# Altium schematic sheet 05_POWER_MCU_1.SchDoc
size 420 x 297 mm; SheetNumber: 8; SheetTotal: 29
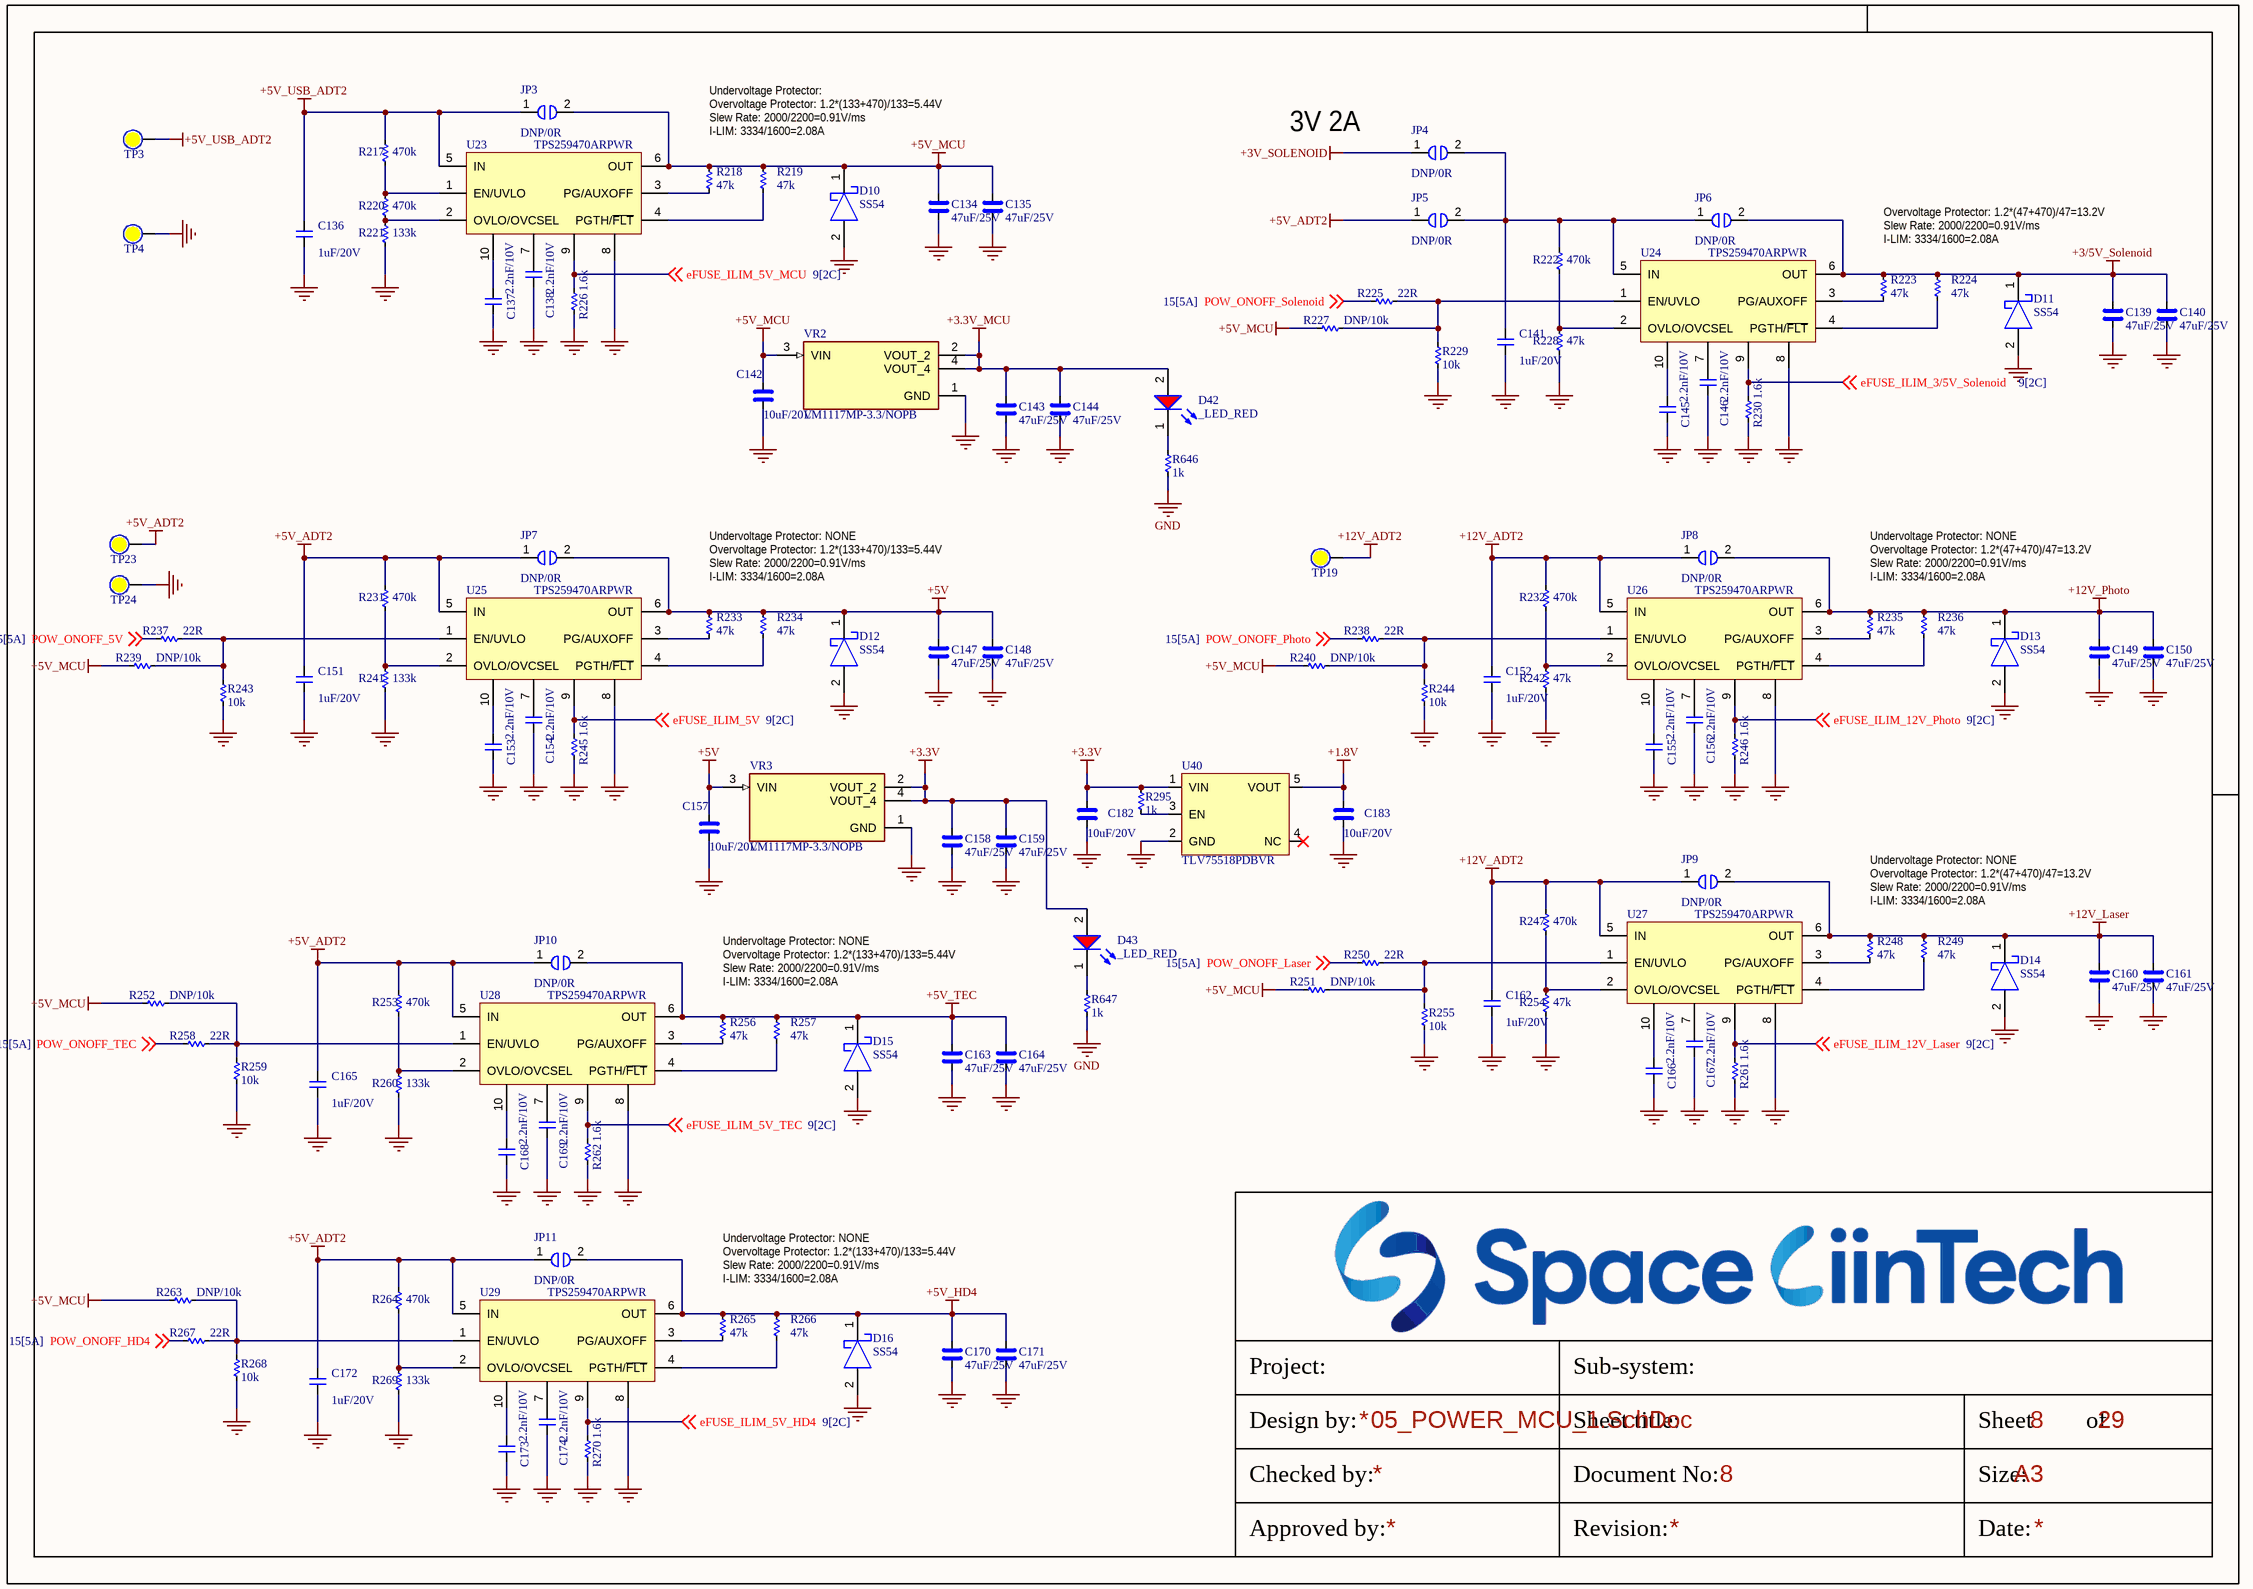
[diagram p0: 05_POWER_MCU_1.SchDoc]

## Parts
C134  47uF/25V  [CAP_C_3225X80]
C135  47uF/25V  [CAP_C_3225X80]
C136  1uF/20V  [CAP_C_1005X60]
C137  2.2nF/10V  [CAP_C_1005X60]
C138  2.2nF/10V  [CAP_C_1005X60]
C139  47uF/25V  [CAP_C_3225X80]
C140  47uF/25V  [CAP_C_3225X80]
C141  1uF/20V  [CAP_C_1005X60]
C142  10uF/20V  [CAP_C_2012X110]
C143  47uF/25V  [CAP_C_3225X80]
C144  47uF/25V  [CAP_C_3225X80]
C145  2.2nF/10V  [CAP_C_1005X60]
C146  2.2nF/10V  [CAP_C_1005X60]
C147  47uF/25V  [CAP_C_3225X80]
C148  47uF/25V  [CAP_C_3225X80]
C149  47uF/25V  [CAP_C_3225X80]
C150  47uF/25V  [CAP_C_3225X80]
C151  1uF/20V  [CAP_C_1005X60]
C152  1uF/20V  [CAP_C_1005X60]
C153  2.2nF/10V  [CAP_C_1005X60]
C154  2.2nF/10V  [CAP_C_1005X60]
C155  2.2nF/10V  [CAP_C_1005X60]
C156  2.2nF/10V  [CAP_C_1005X60]
C157  10uF/20V  [CAP_C_2012X110]
C158  47uF/25V  [CAP_C_3225X80]
C159  47uF/25V  [CAP_C_3225X80]
C160  47uF/25V  [CAP_C_3225X80]
C161  47uF/25V  [CAP_C_3225X80]
C162  1uF/20V  [CAP_C_1005X60]
C163  47uF/25V  [CAP_C_3225X80]
C164  47uF/25V  [CAP_C_3225X80]
C165  1uF/20V  [CAP_C_1005X60]
C166  2.2nF/10V  [CAP_C_1005X60]
C167  2.2nF/10V  [CAP_C_1005X60]
C168  2.2nF/10V  [CAP_C_1005X60]
C169  2.2nF/10V  [CAP_C_1005X60]
C170  47uF/25V  [CAP_C_3225X80]
C171  47uF/25V  [CAP_C_3225X80]
C172  1uF/20V  [CAP_C_1005X60]
C173  2.2nF/10V  [CAP_C_1005X60]
C174  2.2nF/10V  [CAP_C_1005X60]
C182  10uF/20V  [CAP_C_2012X110]
C183  10uF/20V  [CAP_C_2012X110]
D10  SS54  [DO-214AC_SMA]
D11  SS54  [DO-214AC_SMA]
D12  SS54  [DO-214AC_SMA]
D13  SS54  [DO-214AC_SMA]
D14  SS54  [DO-214AC_SMA]
D15  SS54  [DO-214AC_SMA]
D16  SS54  [DO-214AC_SMA]
D42  _LED_RED  [LED_0603]
D43  _LED_RED  [LED_0603]
JP3  DNP/0R  [RES_C_1608X60]
JP4  DNP/0R  [RES_C_1608X60]
JP5  DNP/0R  [RES_C_1608X60]
JP6  DNP/0R  [RES_C_1608X60]
JP7  DNP/0R  [RES_C_1608X60]
JP8  DNP/0R  [RES_C_1608X60]
JP9  DNP/0R  [RES_C_1608X60]
JP10  DNP/0R  [RES_C_1608X60]
JP11  DNP/0R  [RES_C_1608X60]
R217  470k  [RES_C_1005X40]
R218  47k  [RES_C_1005X40]
R219  47k  [RES_C_1005X40]
R220  470k  [RES_C_1005X40]
R221  133k  [RES_C_1005X40]
R222  470k  [RES_C_1005X40]
R223  47k  [RES_C_1005X40]
R224  47k  [RES_C_1005X40]
R225  22R  [RES_C_1005X40]
R226  1.6k  [RES_C_1005X40]
R227  DNP/10k  [RES_C_1005X40]
R228  47k  [RES_C_1005X40]
R229  10k  [RES_C_1005X40]
R230  1.6k  [RES_C_1005X40]
R231  470k  [RES_C_1005X40]
R232  470k  [RES_C_1005X40]
R233  47k  [RES_C_1005X40]
R234  47k  [RES_C_1005X40]
R235  47k  [RES_C_1005X40]
R236  47k  [RES_C_1005X40]
R237  22R  [RES_C_1005X40]
R238  22R  [RES_C_1005X40]
R239  DNP/10k  [RES_C_1005X40]
R240  DNP/10k  [RES_C_1005X40]
R241  133k  [RES_C_1005X40]
R242  47k  [RES_C_1005X40]
R243  10k  [RES_C_1005X40]
R244  10k  [RES_C_1005X40]
R245  1.6k  [RES_C_1005X40]
R246  1.6k  [RES_C_1005X40]
R247  470k  [RES_C_1005X40]
R248  47k  [RES_C_1005X40]
R249  47k  [RES_C_1005X40]
R250  22R  [RES_C_1005X40]
R251  DNP/10k  [RES_C_1005X40]
R252  DNP/10k  [RES_C_1005X40]
R253  470k  [RES_C_1005X40]
R254  47k  [RES_C_1005X40]
R255  10k  [RES_C_1005X40]
R256  47k  [RES_C_1005X40]
R257  47k  [RES_C_1005X40]
R258  22R  [RES_C_1005X40]
R259  10k  [RES_C_1005X40]
R260  133k  [RES_C_1005X40]
R261  1.6k  [RES_C_1005X40]
R262  1.6k  [RES_C_1005X40]
R263  DNP/10k  [RES_C_1005X40]
R264  470k  [RES_C_1005X40]
R265  47k  [RES_C_1005X40]
R266  47k  [RES_C_1005X40]
R267  22R  [RES_C_1005X40]
R268  10k  [RES_C_1005X40]
R269  133k  [RES_C_1005X40]
R270  1.6k  [RES_C_1005X40]
R295  1k  [RES_C_1005X40]
R646  1k  [RES_C_1005X40]
R647  1k  [RES_C_1005X40]
TP3  (no value)  [Testpoint_TH_D130H80]  (no BOM)
TP4  (no value)  [Testpoint_TH_D130H80]  (no BOM)
TP19  (no value)  [Testpoint_TH_D130H80]  (no BOM)
TP23  (no value)  [Testpoint_TH_D130H80]  (no BOM)
TP24  (no value)  [Testpoint_TH_D130H80]  (no BOM)
U23  TPS259470ARPWR  [VQFN-HR-10]
U24  TPS259470ARPWR  [VQFN-HR-10]
U25  TPS259470ARPWR  [VQFN-HR-10]
U26  TPS259470ARPWR  [VQFN-HR-10]
U27  TPS259470ARPWR  [VQFN-HR-10]
U28  TPS259470ARPWR  [VQFN-HR-10]
U29  TPS259470ARPWR  [VQFN-HR-10]
U40  TLV75518PDBVR  [SOT25]
VR2  LM1117MP-3.3/NOPB  [VREG_LM1117MP-3.3/NOPB]
VR3  LM1117MP-3.3/NOPB  [VREG_LM1117MP-3.3/NOPB]

## Nets
+1.8V: C183.1 U40.5(VOUT)
+3.3V: C158.2 C159.2 C182.1 D43.2(A) R295.2 U40.1(VIN) VR3.2(VOUT_2) VR3.4(VOUT_4)
+3.3V_MCU: C143.2 C144.2 D42.2(A) VR2.2(VOUT_2) VR2.4(VOUT_4)
+3/5V_Solenoid: C139.2 C140.2 D11.1 JP6.2 R223.2 R224.2 U24.6(OUT)
+3V_SOLENOID: JP4.1
+5V: C147.2 C148.2 C157.1 D12.1 JP7.2 R233.2 R234.2 U25.6(OUT) VR3.3(VIN)
+5V_ADT2: C151.2 C165.2 C172.2 JP5.1 JP7.1 JP10.1 JP11.1 R231.2 R253.2 R264.2 TP23.1 U25.5(IN) U28.5(IN) U29.5(IN)
+5V_HD4: C170.2 C171.2 D16.1 JP11.2 R265.2 R266.2 U29.6(OUT)
+5V_MCU: C134.2 C135.2 C142.1 D10.1 JP3.2 R218.2 R219.2 R227.2 R239.2 R240.2 R251.2 R252.2 R263.2 U23.6(OUT) VR2.3(VIN)
+5V_TEC: C163.2 C164.2 D15.1 JP10.2 R256.2 R257.2 U28.6(OUT)
+5V_USB_ADT2: C136.2 JP3.1 R217.2 TP3.1 U23.5(IN)
+12V_ADT2: C152.2 C162.2 JP8.1 JP9.1 R232.2 R247.2 TP19.1 U26.5(IN) U27.5(IN)
+12V_Laser: C160.2 C161.2 D14.1 JP9.2 R248.2 R249.2 U27.6(OUT)
+12V_Photo: C149.2 C150.2 D13.1 JP8.2 R235.2 R236.2 U26.6(OUT)
GND: C134.1 C135.1 C136.1 C137.1 C138.1 C139.1 C140.1 C141.1 C142.2 C143.1 C144.1 C145.1 C146.1 C147.1 C148.1 C149.1 C150.1 C151.1 C152.1 C153.1 C154.1 C155.1 C156.1 C157.2 C158.1 C159.1 C160.1 C161.1 C162.1 C163.1 C164.1 C165.1 C166.1 C167.1 C168.1 C169.1 C170.1 C171.1 C172.1 C173.1 C174.1 C182.2 C183.2 D10.2 D11.2 D12.2 D13.2 D14.2 D15.2 D16.2 R221.1 R226.1 R228.1 R229.2 R230.1 R241.1 R242.1 R243.2 R244.2 R245.1 R246.1 R254.1 R255.2 R259.2 R260.1 R261.1 R262.1 R268.2 R269.1 R270.1 R646.1 R647.1 TP4.1 TP24.1 U23.8 U24.8 U25.8 U26.8 U27.8 U28.8 U29.8 U40.2(GND) VR2.1(GND) VR3.1(GND)
eFUSE_ILIM_3/5V_Solenoid: R230.2 U24.9 ; off-sheet eFUSE_ILIM_3/5V_Solenoid
eFUSE_ILIM_5V: R245.2 U25.9 ; off-sheet eFUSE_ILIM_5V
eFUSE_ILIM_5V_HD4: R270.2 U29.9 ; off-sheet eFUSE_ILIM_5V_HD4
eFUSE_ILIM_5V_MCU: R226.2 U23.9 ; off-sheet eFUSE_ILIM_5V_MCU
eFUSE_ILIM_5V_TEC: R262.2 U28.9 ; off-sheet eFUSE_ILIM_5V_TEC
eFUSE_ILIM_12V_Laser: R261.2 U27.9 ; off-sheet eFUSE_ILIM_12V_Laser
eFUSE_ILIM_12V_Photo: R246.2 U26.9 ; off-sheet eFUSE_ILIM_12V_Photo
POW_ONOFF_5V: R237.2 ; off-sheet POW_ONOFF_5V
POW_ONOFF_HD4: R267.2 ; off-sheet POW_ONOFF_HD4
POW_ONOFF_Laser: R250.2 ; off-sheet POW_ONOFF_Laser
POW_ONOFF_Photo: R238.2 ; off-sheet POW_ONOFF_Photo
POW_ONOFF_Solenoid: R225.2 ; off-sheet POW_ONOFF_Solenoid
POW_ONOFF_TEC: R258.2 ; off-sheet POW_ONOFF_TEC
NetC137_2: C137.2 U23.10
NetC138_2: C138.2 U23.7
NetC141_2: C141.2 JP4.2 JP5.2 JP6.1 R222.2 U24.5(IN)
NetC145_2: C145.2 U24.10
NetC146_2: C146.2 U24.7
NetC153_2: C153.2 U25.10
NetC154_2: C154.2 U25.7
NetC155_2: C155.2 U26.10
NetC156_2: C156.2 U26.7
NetC166_2: C166.2 U27.10
NetC167_2: C167.2 U27.7
NetC168_2: C168.2 U28.10
NetC169_2: C169.2 U28.7
NetC173_2: C173.2 U29.10
NetC174_2: C174.2 U29.7
NetD42_1: D42.1(K) R646.2
NetD43_1: D43.1(K) R647.2
NetR217_1: R217.1 R220.2 U23.1(EN/UVLO)
NetR218_1: R218.1 U23.3(PG/AUXOFF)
NetR219_1: R219.1 U23.4(PGTH/~{FLT})
NetR220_1: R220.1 R221.2 U23.2(OVLO/OVCSEL)
NetR222_1: R222.1 R228.2 U24.2(OVLO/OVCSEL)
NetR223_1: R223.1 U24.3(PG/AUXOFF)
NetR224_1: R224.1 U24.4(PGTH/~{FLT})
NetR225_1: R225.1 R227.1 R229.1 U24.1(EN/UVLO)
NetR231_1: R231.1 R241.2 U25.2(OVLO/OVCSEL)
NetR232_1: R232.1 R242.2 U26.2(OVLO/OVCSEL)
NetR233_1: R233.1 U25.3(PG/AUXOFF)
NetR234_1: R234.1 U25.4(PGTH/~{FLT})
NetR235_1: R235.1 U26.3(PG/AUXOFF)
NetR236_1: R236.1 U26.4(PGTH/~{FLT})
NetR237_1: R237.1 R239.1 R243.1 U25.1(EN/UVLO)
NetR238_1: R238.1 R240.1 R244.1 U26.1(EN/UVLO)
NetR247_1: R247.1 R254.2 U27.2(OVLO/OVCSEL)
NetR248_1: R248.1 U27.3(PG/AUXOFF)
NetR249_1: R249.1 U27.4(PGTH/~{FLT})
NetR250_1: R250.1 R251.1 R255.1 U27.1(EN/UVLO)
NetR252_1: R252.1 R258.1 R259.1 U28.1(EN/UVLO)
NetR253_1: R253.1 R260.2 U28.2(OVLO/OVCSEL)
NetR256_1: R256.1 U28.3(PG/AUXOFF)
NetR257_1: R257.1 U28.4(PGTH/~{FLT})
NetR263_1: R263.1 R267.1 R268.1 U29.1(EN/UVLO)
NetR264_1: R264.1 R269.2 U29.2(OVLO/OVCSEL)
NetR265_1: R265.1 U29.3(PG/AUXOFF)
NetR266_1: R266.1 U29.4(PGTH/~{FLT})
NetR295_1: R295.1 U40.3(EN)

Not connected (* = marked no-connect by the designer): U40 4(NC)*

## Notes on the sheet
- Undervoltage Protector:
- Overvoltage Protector: 1.2*(133+470)/133=5.44V
- Slew Rate: 2000/2200=0.91V/ms
- I-LIM: 3334/1600=2.08A
- 3V 2A
- Overvoltage Protector: 1.2*(47+470)/47=13.2V
- Undervoltage Protector: NONE
- Project:
- Sub-system:
- Design by:
- Sheet title:
- Sheet
- of
- Checked by:
- Approved by:
- Revision:
- Document No:
- Size:
- Date:
- A3

## Library data of the parts
C134 C135 C139 C140 C142-C144 C147-C150 C157-C161 C163 C164 C170 C171 C182 C183 = _CAP_C_High_2: CAP CHIP High Value
C136-C138 C141 C145 C146 C151-C156 C162 C165-C169 C172-C174 = _CAP_C_2: CAP CHIP
D10-D16 = SS54: DIODE SCHOTTKY 60V 3A DO214AA
JP3-JP11 = JUMPER_1_1
R217-R270 R295 R646 R647 = _RES_B_2: RES
TP3 TP4 TP19 TP23 TP24 = Test Point: Solder: NF
U40 = IC_POWER_AP7347DQ
VR2 VR3 = LM1117MP-3.3/NOPB: 800-mA 15-V linear voltage regulator; MF: Texas Instruments; SnapEDA_Link: https://www.snapeda.com/parts/LM1117MP-3.3/NOPB/Texas+Instruments/view-part/?ref=snap; Package: SOT-223-4 Texas Instruments; Value: *; MP: LM1117MP-3.3/NOPB; Check_prices: https://www.snapeda.com/parts/LM1117MP-3.3/NOPB/Texas+Instruments/view-part/?ref=eda